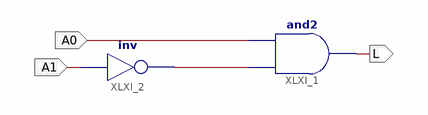
[diagram p0: schematic sheet 1]
// Xilinx ISE schematic Load_Select.sch (spartan3e) as structural Verilog: 2 symbols, 3 ports
module Load_Select (
  input  A0,
  input  A1,
  output L
);

  wire XLXN_1;

  and XLXI_1 (L, XLXN_1, A0);
  not XLXI_2 (XLXN_1, A1);
endmodule
